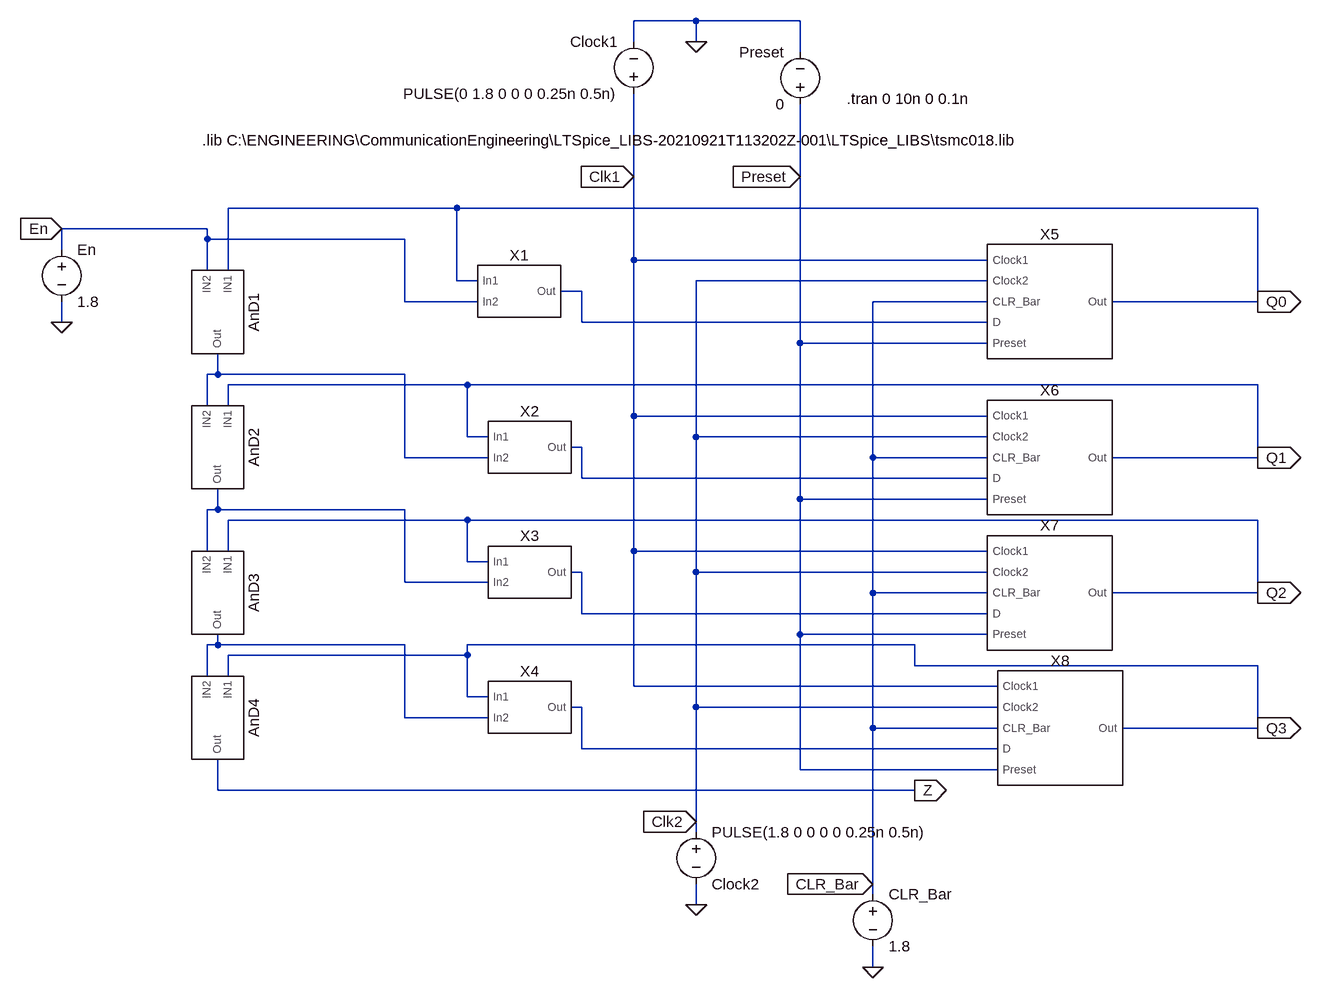
[diagram p0: schematic Counter1_P_Clr.asc]
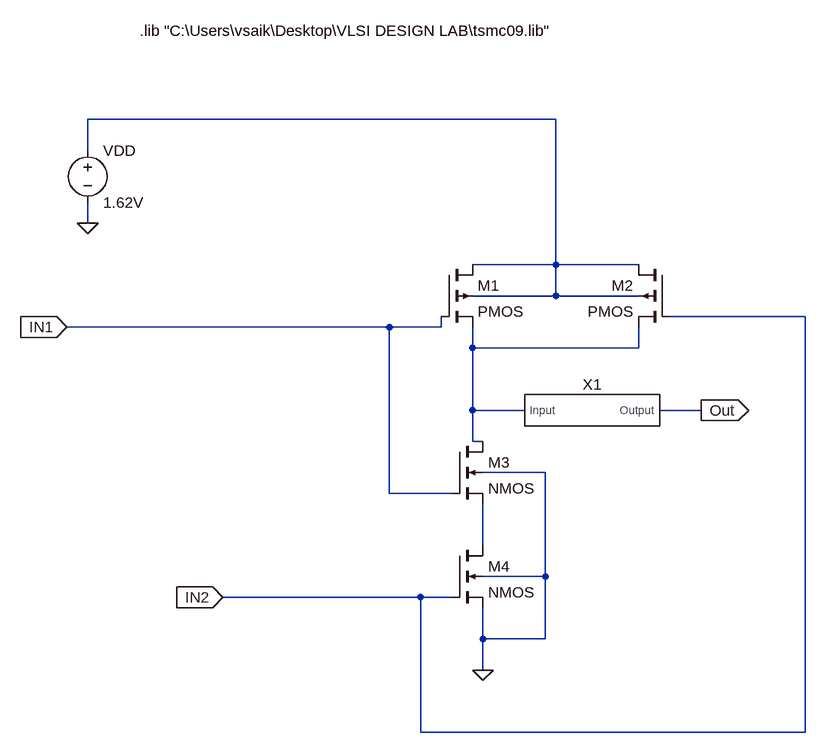
[diagram p1: sub-circuit and_model1.asc]
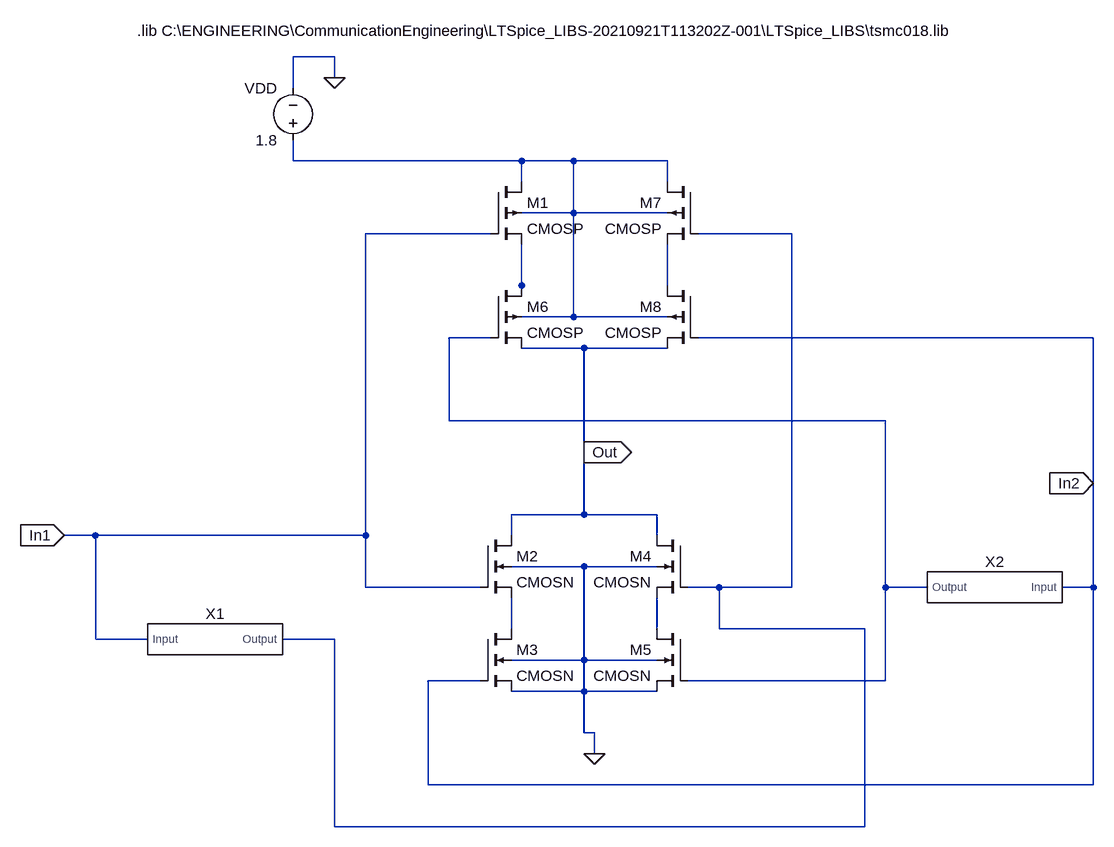
[diagram p2: sub-circuit xor_model1.asc]
Counter1_P_Clr.asc, the LTspice schematic file:
Version 4
SHEET 1 1656 1268
WIRE 416 -208 320 -208
WIRE 576 -208 416 -208
WIRE 320 -176 320 -208
WIRE 416 -176 416 -208
WIRE 576 -160 576 -208
WIRE 320 32 320 -96
WIRE 576 32 576 -80
WIRE 48 80 -304 80
WIRE 1280 80 48 80
WIRE -336 112 -560 112
WIRE -336 128 -336 112
WIRE -32 128 -336 128
WIRE -560 144 -560 112
WIRE 320 160 320 32
WIRE 864 160 320 160
WIRE -336 176 -336 128
WIRE -304 176 -304 80
WIRE 48 192 48 80
WIRE 80 192 48 192
WIRE 864 192 416 192
WIRE 240 208 208 208
WIRE -32 224 -32 128
WIRE 80 224 -32 224
WIRE 864 224 688 224
WIRE 1280 224 1280 80
WIRE 1280 224 1056 224
WIRE -560 256 -560 224
WIRE 240 256 240 208
WIRE 864 256 240 256
WIRE 576 288 576 32
WIRE 864 288 576 288
WIRE -320 336 -320 304
WIRE -320 336 -336 336
WIRE -32 336 -320 336
WIRE 64 352 -304 352
WIRE 1280 352 64 352
WIRE -336 384 -336 336
WIRE -304 384 -304 352
WIRE 320 400 320 160
WIRE 864 400 320 400
WIRE 64 432 64 352
WIRE 96 432 64 432
WIRE 416 432 416 192
WIRE 864 432 416 432
WIRE 240 448 224 448
WIRE -32 464 -32 336
WIRE 96 464 -32 464
WIRE 688 464 688 224
WIRE 864 464 688 464
WIRE 1280 464 1280 352
WIRE 1280 464 1056 464
WIRE 240 496 240 448
WIRE 864 496 240 496
WIRE 576 528 576 288
WIRE 864 528 576 528
WIRE -320 544 -320 512
WIRE -320 544 -336 544
WIRE -32 544 -320 544
WIRE 64 560 -304 560
WIRE 1280 560 64 560
WIRE -336 608 -336 544
WIRE -304 608 -304 560
WIRE 320 608 320 400
WIRE 864 608 320 608
WIRE 64 624 64 560
WIRE 96 624 64 624
WIRE 240 640 224 640
WIRE 416 640 416 432
WIRE 864 640 416 640
WIRE -32 656 -32 544
WIRE 96 656 -32 656
WIRE 688 672 688 464
WIRE 864 672 688 672
WIRE 1280 672 1280 560
WIRE 1280 672 1056 672
WIRE 240 704 240 640
WIRE 864 704 240 704
WIRE 576 736 576 528
WIRE 864 736 576 736
WIRE -320 752 -320 736
WIRE -320 752 -336 752
WIRE -32 752 -320 752
WIRE 752 752 64 752
WIRE 64 768 64 752
WIRE 64 768 -304 768
WIRE 752 784 752 752
WIRE 1280 784 752 784
WIRE -336 800 -336 752
WIRE -304 800 -304 768
WIRE 320 816 320 608
WIRE 880 816 320 816
WIRE 64 832 64 768
WIRE 96 832 64 832
WIRE 240 848 224 848
WIRE 416 848 416 640
WIRE 880 848 416 848
WIRE -32 864 -32 752
WIRE 96 864 -32 864
WIRE 688 880 688 672
WIRE 880 880 688 880
WIRE 1280 880 1280 784
WIRE 1280 880 1072 880
WIRE 240 912 240 848
WIRE 880 912 240 912
WIRE 576 944 576 736
WIRE 880 944 576 944
WIRE -320 976 -320 928
WIRE 752 976 -320 976
WIRE 416 1024 416 848
WIRE 416 1040 416 1024
WIRE 688 1120 688 880
WIRE 688 1136 688 1120
WIRE 416 1152 416 1120
WIRE 688 1248 688 1216
FLAG -560 256 0
FLAG 416 -176 0
FLAG 752 976 Z
IOPIN 752 976 Out
FLAG 416 1152 0
FLAG 688 1248 0
FLAG 1280 224 Q0
IOPIN 1280 224 Out
FLAG 1280 464 Q1
IOPIN 1280 464 Out
FLAG 1280 672 Q2
IOPIN 1280 672 Out
FLAG 1280 880 Q3
IOPIN 1280 880 Out
FLAG 320 32 Clk1
IOPIN 320 32 In
FLAG 416 1024 Clk2
IOPIN 416 1024 In
FLAG 688 1120 CLR_Bar
IOPIN 688 1120 In
FLAG 576 32 Preset
IOPIN 576 32 In
FLAG -560 112 En
IOPIN -560 112 In
SYMBOL AND_model1 -320 240 R90
SYMATTR InstName AnD1
SYMBOL AND_model1 -320 448 R90
SYMATTR InstName AnD2
SYMBOL AND_model1 -320 672 R90
SYMATTR InstName AnD3
SYMBOL AND_model1 -320 864 R90
SYMATTR InstName AnD4
SYMBOL XOR_model1 144 208 R0
SYMATTR InstName X1
SYMBOL XOR_model1 160 448 R0
SYMATTR InstName X2
SYMBOL XOR_model1 160 640 R0
SYMATTR InstName X3
SYMBOL XOR_model1 160 848 R0
SYMATTR InstName X4
SYMBOL voltage -560 128 R0
SYMATTR InstName En
SYMATTR Value 1.8
SYMBOL voltage 320 -80 R180
WINDOW 0 24 96 Left 2
WINDOW 3 24 16 Left 2
WINDOW 123 0 0 Left 0
WINDOW 39 0 0 Left 0
SYMATTR InstName Clock1
SYMATTR Value PULSE(0 1.8 0 0 0 0.25n 0.5n)
SYMBOL voltage 416 1024 R0
WINDOW 0 24 96 Left 2
WINDOW 3 24 16 Left 2
WINDOW 123 0 0 Left 0
WINDOW 39 0 0 Left 0
SYMATTR InstName Clock2
SYMATTR Value PULSE(1.8 0 0 0 0 0.25n 0.5n)
SYMBOL voltage 688 1120 R0
WINDOW 123 0 0 Left 0
WINDOW 39 0 0 Left 0
SYMATTR InstName CLR_Bar
SYMATTR Value 1.8
SYMBOL voltage 576 -64 R180
WINDOW 0 24 96 Left 2
WINDOW 3 24 16 Left 2
WINDOW 123 0 0 Left 0
WINDOW 39 0 0 Left 0
SYMATTR InstName Preset
SYMATTR Value 0
SYMBOL D_Flip_Flop_880_440_buffer_Pr_Clr 960 224 R0
SYMATTR InstName X5
SYMBOL D_Flip_Flop_880_440_buffer_Pr_Clr 960 464 R0
SYMATTR InstName X6
SYMBOL D_Flip_Flop_880_440_buffer_Pr_Clr 960 672 R0
SYMATTR InstName X7
SYMBOL D_Flip_Flop_880_440_buffer_Pr_Clr 976 880 R0
SYMATTR InstName X8
TEXT -344 -24 Left 2 !.lib C:\\ENGINEERING\\CommunicationEngineering\\LTSpice_LIBS-20210921T113202Z-001\\LTSpice_LIBS\\tsmc018.lib
TEXT 648 -88 Left 2 !.tran 0 10n 0 0.1n

and_model1.asc, the sub-circuit schematic file:
Version 4
SHEET 1 1644 1012
WIRE 912 64 192 64
WIRE 192 112 192 64
WIRE 192 224 192 192
WIRE 912 288 912 64
WIRE 912 288 784 288
WIRE 1040 288 912 288
WIRE 912 336 912 288
WIRE 912 336 784 336
WIRE 1040 336 912 336
WIRE 1296 368 1088 368
WIRE 656 384 160 384
WIRE 736 384 736 368
WIRE 736 384 656 384
WIRE 784 416 784 384
WIRE 1040 416 1040 384
WIRE 1040 416 784 416
WIRE 784 512 784 416
WIRE 864 512 784 512
WIRE 1136 512 1072 512
WIRE 784 560 784 512
WIRE 800 560 784 560
WIRE 896 608 800 608
WIRE 656 640 656 384
WIRE 752 640 656 640
WIRE 800 720 800 656
WIRE 896 768 896 608
WIRE 896 768 800 768
WIRE 704 800 400 800
WIRE 752 800 704 800
WIRE 800 864 800 816
WIRE 896 864 896 768
WIRE 896 864 800 864
WIRE 800 912 800 864
WIRE 704 1008 704 800
WIRE 1296 1008 1296 368
WIRE 1296 1008 704 1008
FLAG 192 224 0
FLAG 800 912 0
FLAG 1136 512 Out
IOPIN 1136 512 Out
FLAG 160 384 IN1
IOPIN 160 384 In
FLAG 400 800 IN2
IOPIN 400 800 In
SYMBOL pmos4 736 288 R0
SYMATTR InstName M1
SYMATTR Value2 l=90n w=440n
SYMBOL pmos4 1088 288 M0
SYMATTR InstName M2
SYMATTR Value2 l=90n w=440n
SYMBOL nmos4 752 560 R0
SYMATTR InstName M3
SYMATTR Value2 l=90n w=220n
SYMBOL nmos4 752 720 R0
SYMATTR InstName M4
SYMATTR Value2 l=90n w=220n
SYMBOL voltage 192 96 R0
SYMATTR InstName VDD
SYMATTR Value 1.62V
SYMBOL NOT_model1 960 512 R0
SYMATTR InstName X1
TEXT 272 -72 Left 2 !.lib "C:\\Users\\vsaik\\Desktop\\VLSI DESIGN LAB\\tsmc09.lib"

xor_model1.asc, the sub-circuit schematic file:
Version 4
SHEET 1 2196 1236
WIRE 480 48 416 48
WIRE 480 80 480 48
WIRE 416 96 416 48
WIRE 416 208 416 176
WIRE 768 208 416 208
WIRE 848 208 768 208
WIRE 992 208 848 208
WIRE 768 240 768 208
WIRE 992 240 992 208
WIRE 848 288 848 208
WIRE 848 288 768 288
WIRE 992 288 848 288
WIRE 720 320 528 320
WIRE 1184 320 1040 320
WIRE 768 400 768 336
WIRE 992 400 992 336
WIRE 768 416 768 400
WIRE 848 448 848 288
WIRE 848 448 768 448
WIRE 992 448 848 448
WIRE 720 480 656 480
WIRE 1648 480 1040 480
WIRE 864 496 768 496
WIRE 992 496 864 496
WIRE 656 608 656 480
WIRE 1328 608 656 608
WIRE 864 656 864 496
WIRE 1648 704 1648 480
WIRE 864 752 864 656
WIRE 864 752 752 752
WIRE 976 752 864 752
WIRE 112 784 64 784
WIRE 528 784 528 320
WIRE 528 784 112 784
WIRE 752 784 752 752
WIRE 976 784 976 752
WIRE 864 832 752 832
WIRE 976 832 864 832
WIRE 528 864 528 784
WIRE 704 864 528 864
WIRE 1072 864 1024 864
WIRE 1184 864 1184 320
WIRE 1184 864 1072 864
WIRE 1328 864 1328 608
WIRE 1392 864 1328 864
WIRE 1648 864 1648 704
WIRE 1648 864 1600 864
WIRE 752 928 752 880
WIRE 976 928 976 880
WIRE 1072 928 1072 864
WIRE 1296 928 1072 928
WIRE 112 944 112 784
WIRE 192 944 112 944
WIRE 480 944 400 944
WIRE 864 976 864 832
WIRE 864 976 752 976
WIRE 976 976 864 976
WIRE 704 1008 624 1008
WIRE 1328 1008 1328 864
WIRE 1328 1008 1024 1008
WIRE 864 1024 864 976
WIRE 864 1024 752 1024
WIRE 976 1024 864 1024
WIRE 864 1088 864 1024
WIRE 880 1088 864 1088
WIRE 880 1120 880 1088
WIRE 624 1168 624 1008
WIRE 1648 1168 1648 864
WIRE 1648 1168 624 1168
WIRE 480 1232 480 944
WIRE 1296 1232 1296 928
WIRE 1296 1232 480 1232
FLAG 480 80 0
FLAG 880 1120 0
FLAG 64 784 In1
IOPIN 64 784 In
FLAG 1648 704 In2
IOPIN 1648 704 In
FLAG 864 656 Out
IOPIN 864 656 Out
SYMBOL pmos4 720 240 R0
SYMATTR InstName M1
SYMATTR Value CMOSP
SYMATTR Value2 l=180n w=1320n
SYMBOL nmos4 704 784 R0
SYMATTR InstName M2
SYMATTR Value CMOSN
SYMATTR Value2 l=180n w=440n
SYMBOL nmos4 704 928 R0
SYMATTR InstName M3
SYMATTR Value CMOSN
SYMATTR Value2 l=180n w=440n
SYMBOL nmos4 1024 784 M0
SYMATTR InstName M4
SYMATTR Value CMOSN
SYMATTR Value2 l=180n w=440n
SYMBOL nmos4 1024 928 M0
SYMATTR InstName M5
SYMATTR Value CMOSN
SYMATTR Value2 l=180n w=440n
SYMBOL voltage 416 192 R180
WINDOW 0 24 96 Left 2
WINDOW 3 24 16 Left 2
SYMATTR InstName VDD
SYMATTR Value 1.8
SYMBOL pmos4 720 400 R0
SYMATTR InstName M6
SYMATTR Value CMOSP
SYMATTR Value2 l=180n w=1320n
SYMBOL pmos4 1040 240 M0
SYMATTR InstName M7
SYMATTR Value CMOSP
SYMATTR Value2 l=180n w=1320n
SYMBOL pmos4 1040 400 M0
SYMATTR InstName M8
SYMATTR Value CMOSP
SYMATTR Value2 l=180n w=1320n
SYMBOL NOT_model1 288 944 R0
SYMATTR InstName X1
SYMBOL NOT_model1 1504 864 M0
SYMATTR InstName X2
TEXT 176 8 Left 2 !.lib C:\\ENGINEERING\\CommunicationEngineering\\LTSpice_LIBS-20210921T113202Z-001\\LTSpice_LIBS\\tsmc018.lib

The netlist it stands for:
* Counter1_P_Clr.asc
XAnD1 Q0 En N002 and_model1
XAnD2 Q1 N002 N004 and_model1
XAnD3 Q2 N004 N006 and_model1
XAnD4 Q3 N006 Z and_model1
XX1 Q0 En N001 xor_model1
XX2 Q1 N002 N003 xor_model1
XX3 Q2 N004 N005 xor_model1
XX4 Q3 N006 N007 xor_model1
V§En En 0 1.8
V§Clock1 Clk1 0 PULSE(0 1.8 0 0 0 0.25n 0.5n)
V§Clock2 Clk2 0 PULSE(1.8 0 0 0 0 0.25n 0.5n)
V§CLR_Bar CLR_Bar 0 1.8
V§Preset Preset 0 0
XX5 Clk1 Clk2 CLR_Bar N001 Preset Q0 DFF0  ; pins Clock1 Clock2 CLR_Bar D Preset Out
XX6 Clk1 Clk2 CLR_Bar N003 Preset Q1 DFF0  ; pins Clock1 Clock2 CLR_Bar D Preset Out
XX7 Clk1 Clk2 CLR_Bar N005 Preset Q2 DFF0  ; pins Clock1 Clock2 CLR_Bar D Preset Out
XX8 Clk1 Clk2 CLR_Bar N007 Preset Q3 DFF0  ; pins Clock1 Clock2 CLR_Bar D Preset Out

* block symbol definitions
.subckt and_model1 IN1 IN2 Out
M1 N001 IN1 N002 N001 PMOS l=90n w=440n
M2 N001 IN2 N002 N001 PMOS l=90n w=440n
M3 N002 IN1 N003 0 NMOS l=90n w=220n
M4 N003 IN2 0 0 NMOS l=90n w=220n
VDD N001 0 1.62V
XX1 N002 Out NOT0  ; pins Input Output
.lib "C:\Users\vsaik\Desktop\VLSI DESIGN LAB\tsmc09.lib"
.ends and_model1

.subckt xor_model1 In1 In2 Out
M1 N001 In1 N003 N001 CMOSP l=180n w=1320n
M2 Out In1 N006 0 CMOSN l=180n w=440n
M3 N006 In2 0 0 CMOSN l=180n w=440n
M4 Out N002 N007 0 CMOSN l=180n w=440n
M5 N007 N005 0 0 CMOSN l=180n w=440n
VDD N001 0 1.8
M6 N003 N005 Out N001 CMOSP l=180n w=1320n
M7 N001 N002 N004 N001 CMOSP l=180n w=1320n
M8 N004 In2 Out N001 CMOSP l=180n w=1320n
XX1 In1 N002 NOT0  ; pins Input Output
XX2 In2 N005 NOT0  ; pins Input Output
.lib C:\ENGINEERING\CommunicationEngineering\LTSpice_LIBS-20210921T113202Z-001\LTSpice_LIBS\tsmc018.lib
.ends xor_model1

.model NMOS NMOS
.model PMOS PMOS
.lib standard.mos
.lib C:\ENGINEERING\CommunicationEngineering\LTSpice_LIBS-20210921T113202Z-001\LTSpice_LIBS\tsmc018.lib
.tran 0 10n 0 0.1n
.backanno
.end